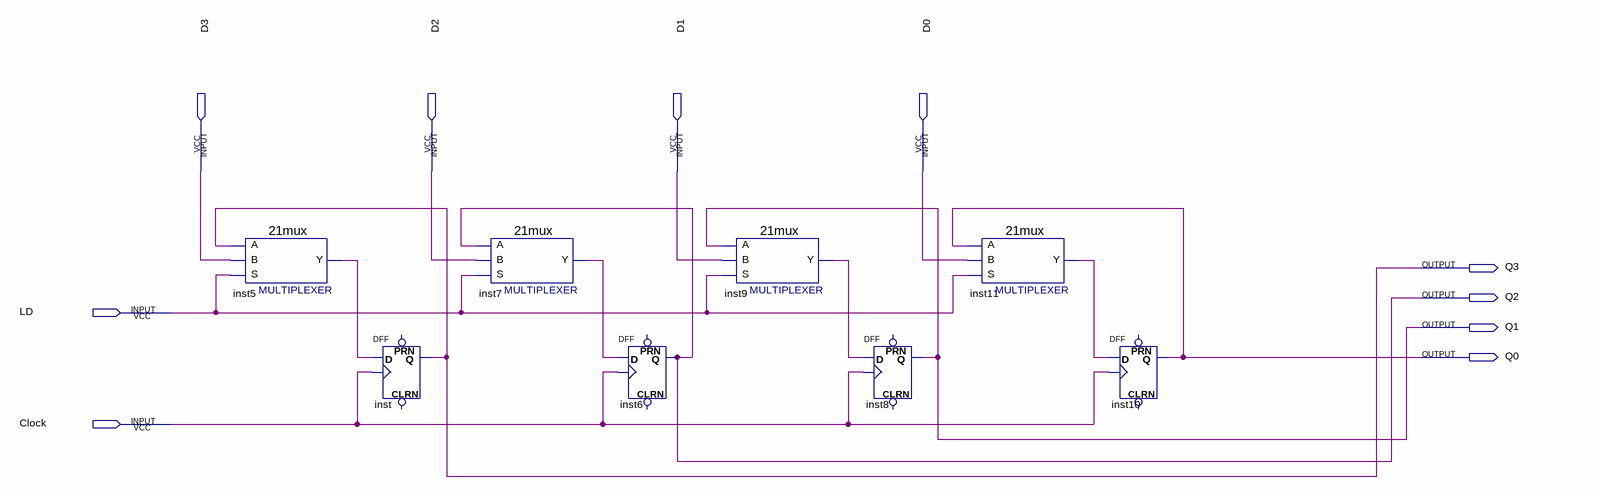
[diagram p0: schematic sheet]
// Quartus schematic 4-bit_wide_register.bdf as structural Verilog: 8 symbols, 10 pins
module \4-bit_wide_register  (
  input  D3,
  input  D2,
  input  D1,
  input  D0,
  input  LD,
  input  Clock,
  output Q3,
  output Q2,
  output Q1,
  output Q0
);

  wire inst5_y, inst7_y, inst9_y, inst11_y;

  \21mux  inst5 (.S(LD), .B(D3), .A(Q3), .Y(inst5_y));
  DFF inst (.CLK(Clock), .D(inst5_y), .Q(Q3));  // open: CLRN, PRN
  \21mux  inst7 (.S(LD), .B(D2), .A(Q2), .Y(inst7_y));
  DFF inst6 (.CLK(Clock), .D(inst7_y), .Q(Q2));  // open: CLRN, PRN
  \21mux  inst9 (.S(LD), .B(D1), .A(Q1), .Y(inst9_y));
  DFF inst8 (.CLK(Clock), .D(inst9_y), .Q(Q1));  // open: CLRN, PRN
  \21mux  inst11 (.S(LD), .B(D0), .A(Q0), .Y(inst11_y));
  DFF inst10 (.CLK(Clock), .D(inst11_y), .Q(Q0));  // open: CLRN, PRN
endmodule
